# EAGLE design majorproject2_jlcpcb_final (EAGLE 9.2.2)
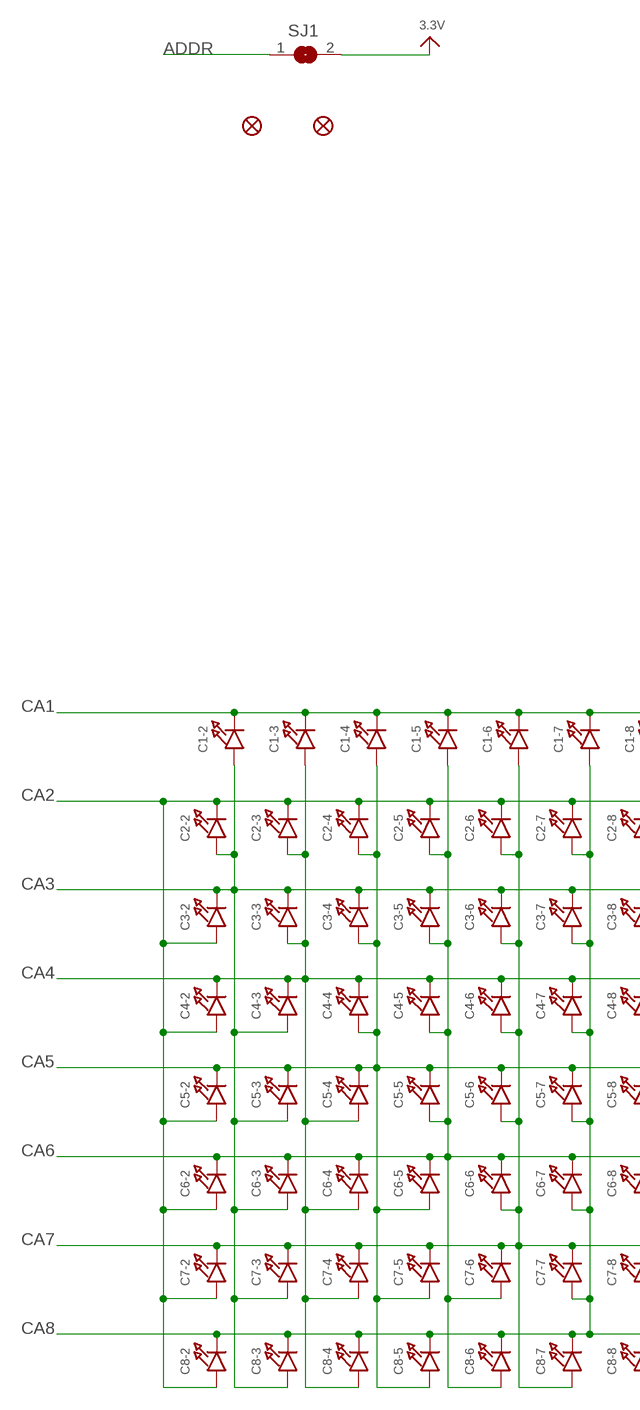
[diagram p0: schematic, sheet 1, part 1 of 2]
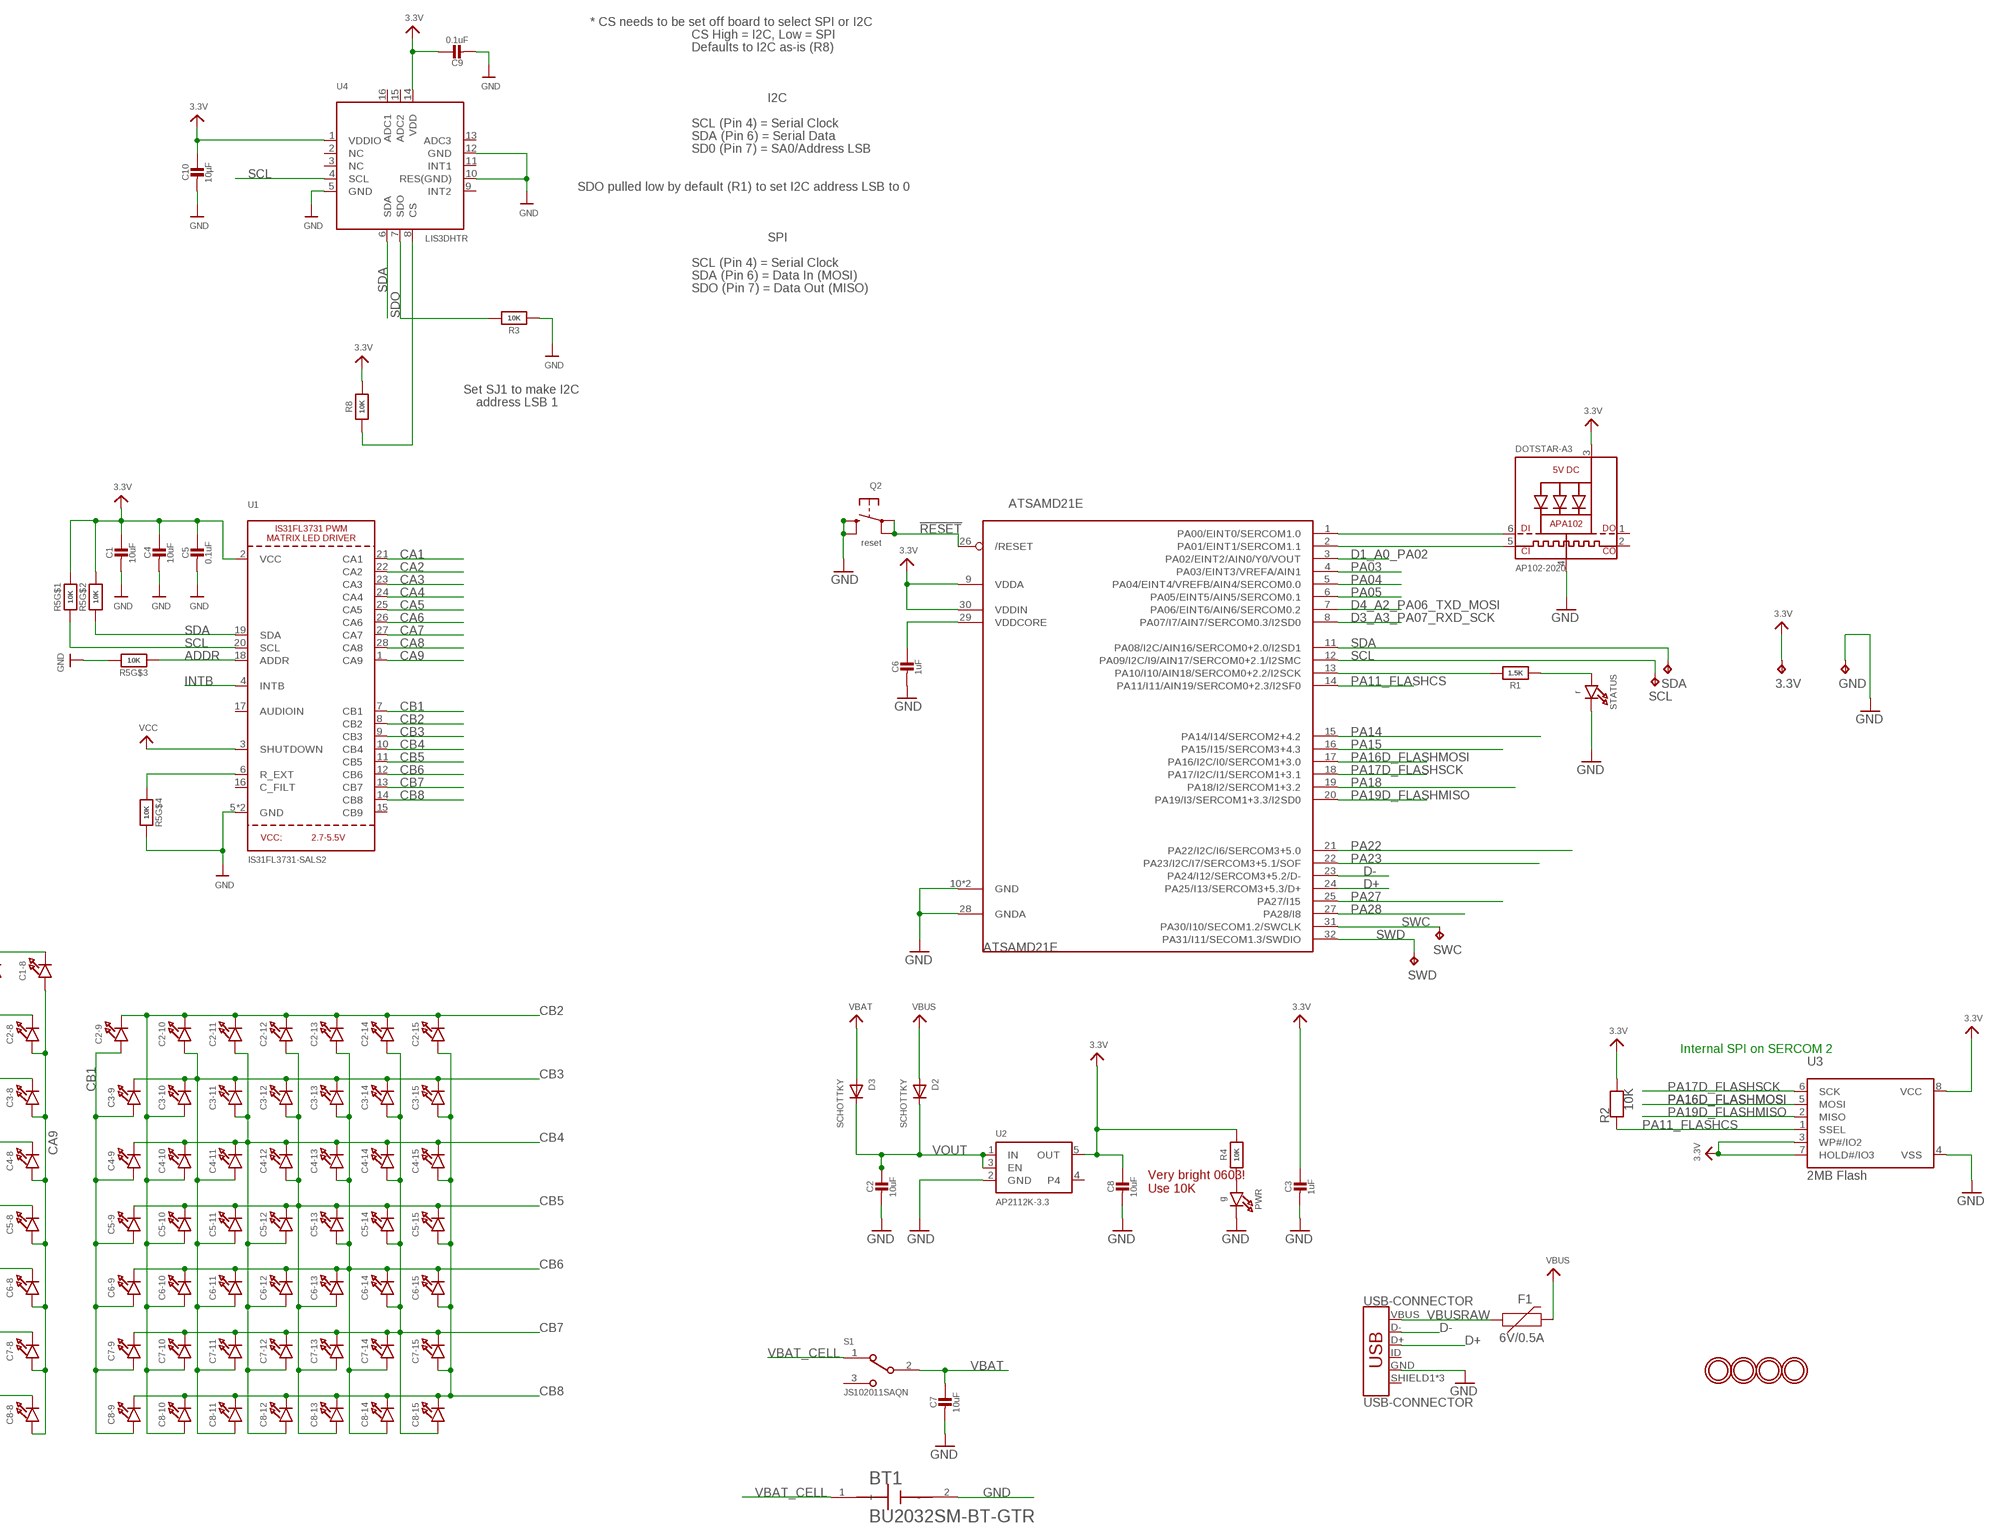
[diagram p1: schematic, sheet 1, part 2 of 2]

## Parts
3.3V  TPB1,27  [B1,27]
ATSAMD21E  ATSAMD21E  [QFN32_5MM]
BT1  BU2032SM-BT-GTR  [BAT_BU2032SM-BT-GTR]
C1  10uF  CAP_CERAMIC0805-NOOUTLINE  [0805-NO]
C1-2  LED0603_NOOUTLINE  [CHIPLED_0603_NOOUTLINE]
C1-3  LED0603_NOOUTLINE  [CHIPLED_0603_NOOUTLINE]
C1-4  LED0603_NOOUTLINE  [CHIPLED_0603_NOOUTLINE]
C1-5  LED0603_NOOUTLINE  [CHIPLED_0603_NOOUTLINE]
C1-6  LED0603_NOOUTLINE  [CHIPLED_0603_NOOUTLINE]
C1-7  LED0603_NOOUTLINE  [CHIPLED_0603_NOOUTLINE]
C1-8  LED0603_NOOUTLINE  [CHIPLED_0603_NOOUTLINE]
C2  10uF  CAP_CERAMIC0805-NOOUTLINE  [0805-NO]
C2-2  LED0603_NOOUTLINE  [CHIPLED_0603_NOOUTLINE]
C2-3  LED0603_NOOUTLINE  [CHIPLED_0603_NOOUTLINE]
C2-4  LED0603_NOOUTLINE  [CHIPLED_0603_NOOUTLINE]
C2-5  LED0603_NOOUTLINE  [CHIPLED_0603_NOOUTLINE]
C2-6  LED0603_NOOUTLINE  [CHIPLED_0603_NOOUTLINE]
C2-7  LED0603_NOOUTLINE  [CHIPLED_0603_NOOUTLINE]
C2-8  LED0603_NOOUTLINE  [CHIPLED_0603_NOOUTLINE]
C2-9  LED0603_NOOUTLINE  [CHIPLED_0603_NOOUTLINE]
C2-10  LED0603_NOOUTLINE  [CHIPLED_0603_NOOUTLINE]
C2-11  LED0603_NOOUTLINE  [CHIPLED_0603_NOOUTLINE]
C2-12  LED0603_NOOUTLINE  [CHIPLED_0603_NOOUTLINE]
C2-13  LED0603_NOOUTLINE  [CHIPLED_0603_NOOUTLINE]
C2-14  LED0603_NOOUTLINE  [CHIPLED_0603_NOOUTLINE]
C2-15  LED0603_NOOUTLINE  [CHIPLED_0603_NOOUTLINE]
C3  1uF  CAP_CERAMIC0603_NO  [0603-NO]
C3-2  LED0603_NOOUTLINE  [CHIPLED_0603_NOOUTLINE]
C3-3  LED0603_NOOUTLINE  [CHIPLED_0603_NOOUTLINE]
C3-4  LED0603_NOOUTLINE  [CHIPLED_0603_NOOUTLINE]
C3-5  LED0603_NOOUTLINE  [CHIPLED_0603_NOOUTLINE]
C3-6  LED0603_NOOUTLINE  [CHIPLED_0603_NOOUTLINE]
C3-7  LED0603_NOOUTLINE  [CHIPLED_0603_NOOUTLINE]
C3-8  LED0603_NOOUTLINE  [CHIPLED_0603_NOOUTLINE]
C3-9  LED0603_NOOUTLINE  [CHIPLED_0603_NOOUTLINE]
C3-10  LED0603_NOOUTLINE  [CHIPLED_0603_NOOUTLINE]
C3-11  LED0603_NOOUTLINE  [CHIPLED_0603_NOOUTLINE]
C3-12  LED0603_NOOUTLINE  [CHIPLED_0603_NOOUTLINE]
C3-13  LED0603_NOOUTLINE  [CHIPLED_0603_NOOUTLINE]
C3-14  LED0603_NOOUTLINE  [CHIPLED_0603_NOOUTLINE]
C3-15  LED0603_NOOUTLINE  [CHIPLED_0603_NOOUTLINE]
C4  10uF  CAP_CERAMIC0805-NOOUTLINE  [0805-NO]
C4-2  LED0603_NOOUTLINE  [CHIPLED_0603_NOOUTLINE]
C4-3  LED0603_NOOUTLINE  [CHIPLED_0603_NOOUTLINE]
C4-4  LED0603_NOOUTLINE  [CHIPLED_0603_NOOUTLINE]
C4-5  LED0603_NOOUTLINE  [CHIPLED_0603_NOOUTLINE]
C4-6  LED0603_NOOUTLINE  [CHIPLED_0603_NOOUTLINE]
C4-7  LED0603_NOOUTLINE  [CHIPLED_0603_NOOUTLINE]
C4-8  LED0603_NOOUTLINE  [CHIPLED_0603_NOOUTLINE]
C4-9  LED0603_NOOUTLINE  [CHIPLED_0603_NOOUTLINE]
C4-10  LED0603_NOOUTLINE  [CHIPLED_0603_NOOUTLINE]
C4-11  LED0603_NOOUTLINE  [CHIPLED_0603_NOOUTLINE]
C4-12  LED0603_NOOUTLINE  [CHIPLED_0603_NOOUTLINE]
C4-13  LED0603_NOOUTLINE  [CHIPLED_0603_NOOUTLINE]
C4-14  LED0603_NOOUTLINE  [CHIPLED_0603_NOOUTLINE]
C4-15  LED0603_NOOUTLINE  [CHIPLED_0603_NOOUTLINE]
C5  0.1uF  CAP_CERAMIC0805-NOOUTLINE  [0805-NO]
C5-2  LED0603_NOOUTLINE  [CHIPLED_0603_NOOUTLINE]
C5-3  LED0603_NOOUTLINE  [CHIPLED_0603_NOOUTLINE]
C5-4  LED0603_NOOUTLINE  [CHIPLED_0603_NOOUTLINE]
C5-5  LED0603_NOOUTLINE  [CHIPLED_0603_NOOUTLINE]
C5-6  LED0603_NOOUTLINE  [CHIPLED_0603_NOOUTLINE]
C5-7  LED0603_NOOUTLINE  [CHIPLED_0603_NOOUTLINE]
C5-8  LED0603_NOOUTLINE  [CHIPLED_0603_NOOUTLINE]
C5-9  LED0603_NOOUTLINE  [CHIPLED_0603_NOOUTLINE]
C5-10  LED0603_NOOUTLINE  [CHIPLED_0603_NOOUTLINE]
C5-11  LED0603_NOOUTLINE  [CHIPLED_0603_NOOUTLINE]
C5-12  LED0603_NOOUTLINE  [CHIPLED_0603_NOOUTLINE]
C5-13  LED0603_NOOUTLINE  [CHIPLED_0603_NOOUTLINE]
C5-14  LED0603_NOOUTLINE  [CHIPLED_0603_NOOUTLINE]
C5-15  LED0603_NOOUTLINE  [CHIPLED_0603_NOOUTLINE]
C6  1uF  CAP_CERAMIC0603_NO  [0603-NO]
C6-2  LED0603_NOOUTLINE  [CHIPLED_0603_NOOUTLINE]
C6-3  LED0603_NOOUTLINE  [CHIPLED_0603_NOOUTLINE]
C6-4  LED0603_NOOUTLINE  [CHIPLED_0603_NOOUTLINE]
C6-5  LED0603_NOOUTLINE  [CHIPLED_0603_NOOUTLINE]
C6-6  LED0603_NOOUTLINE  [CHIPLED_0603_NOOUTLINE]
C6-7  LED0603_NOOUTLINE  [CHIPLED_0603_NOOUTLINE]
C6-8  LED0603_NOOUTLINE  [CHIPLED_0603_NOOUTLINE]
C6-9  LED0603_NOOUTLINE  [CHIPLED_0603_NOOUTLINE]
C6-10  LED0603_NOOUTLINE  [CHIPLED_0603_NOOUTLINE]
C6-11  LED0603_NOOUTLINE  [CHIPLED_0603_NOOUTLINE]
C6-12  LED0603_NOOUTLINE  [CHIPLED_0603_NOOUTLINE]
C6-13  LED0603_NOOUTLINE  [CHIPLED_0603_NOOUTLINE]
C6-14  LED0603_NOOUTLINE  [CHIPLED_0603_NOOUTLINE]
C6-15  LED0603_NOOUTLINE  [CHIPLED_0603_NOOUTLINE]
C7  10uF  CAP_CERAMIC0805-NOOUTLINE  [0805-NO]
C7-2  LED0603_NOOUTLINE  [CHIPLED_0603_NOOUTLINE]
C7-3  LED0603_NOOUTLINE  [CHIPLED_0603_NOOUTLINE]
C7-4  LED0603_NOOUTLINE  [CHIPLED_0603_NOOUTLINE]
C7-5  LED0603_NOOUTLINE  [CHIPLED_0603_NOOUTLINE]
C7-6  LED0603_NOOUTLINE  [CHIPLED_0603_NOOUTLINE]
C7-7  LED0603_NOOUTLINE  [CHIPLED_0603_NOOUTLINE]
C7-8  LED0603_NOOUTLINE  [CHIPLED_0603_NOOUTLINE]
C7-9  LED0603_NOOUTLINE  [CHIPLED_0603_NOOUTLINE]
C7-10  LED0603_NOOUTLINE  [CHIPLED_0603_NOOUTLINE]
C7-11  LED0603_NOOUTLINE  [CHIPLED_0603_NOOUTLINE]
C7-12  LED0603_NOOUTLINE  [CHIPLED_0603_NOOUTLINE]
C7-13  LED0603_NOOUTLINE  [CHIPLED_0603_NOOUTLINE]
C7-14  LED0603_NOOUTLINE  [CHIPLED_0603_NOOUTLINE]
C7-15  LED0603_NOOUTLINE  [CHIPLED_0603_NOOUTLINE]
C8  10uF  CAP_CERAMIC0805-NOOUTLINE  [0805-NO]
C8-2  LED0603_NOOUTLINE  [CHIPLED_0603_NOOUTLINE]
C8-3  LED0603_NOOUTLINE  [CHIPLED_0603_NOOUTLINE]
C8-4  LED0603_NOOUTLINE  [CHIPLED_0603_NOOUTLINE]
C8-5  LED0603_NOOUTLINE  [CHIPLED_0603_NOOUTLINE]
C8-6  LED0603_NOOUTLINE  [CHIPLED_0603_NOOUTLINE]
C8-7  LED0603_NOOUTLINE  [CHIPLED_0603_NOOUTLINE]
C8-8  LED0603_NOOUTLINE  [CHIPLED_0603_NOOUTLINE]
C8-9  LED0603_NOOUTLINE  [CHIPLED_0603_NOOUTLINE]
C8-10  LED0603_NOOUTLINE  [CHIPLED_0603_NOOUTLINE]
C8-11  LED0603_NOOUTLINE  [CHIPLED_0603_NOOUTLINE]
C8-12  LED0603_NOOUTLINE  [CHIPLED_0603_NOOUTLINE]
C8-13  LED0603_NOOUTLINE  [CHIPLED_0603_NOOUTLINE]
C8-14  LED0603_NOOUTLINE  [CHIPLED_0603_NOOUTLINE]
C8-15  LED0603_NOOUTLINE  [CHIPLED_0603_NOOUTLINE]
C9  0.1uF  CAP_CERAMIC0805_10MGAP  [0805_10MGAP]
C10  10µF  CAP_CERAMIC0805-NOOUTLINE  [0805-NO]
D2  SCHOTTKY  DIODE_SOD-123FL  [SOD-123FL]
D3  SCHOTTKY  DIODE_SOD-123FL  [SOD-123FL]
DOTSTAR-A3  AP102-2020  APA1022020  [APA102_2020]
F1  6V/0.5A  PPTC_HALF-AMP  [1206]
FID1  FIDUCIAL""  [FIDUCIAL_1MM]
FID2  FIDUCIAL""  [FIDUCIAL_1MM]
GND  TPB1,27  [B1,27]
PWR  g  LED0603_NOOUTLINE  [CHIPLED_0603_NOOUTLINE]
Q2  reset  SWITCH_TACT_SMT4.6X2.8  [BTN_KMR2_4.6X2.8]
R1  1.5K  RESISTOR_0603_NOOUT  [0603-NO]
R2  10K  RESISTOR_0603_NOOUT  [0603-NO]
R3  10K  RESISTOR0805_NOOUTLINE  [0805-NO]
R4  10K  RESISTOR_0603_NOOUT  [0603-NO]
R5  10K  RESISTOR_4PACK  [RESPACK_4X0603]
R8  10K  RESISTOR0805_NOOUTLINE  [0805-NO]
S1  JS102011SAQN  [SW_JS102011SAQN]
SCL  TPB1,27  [B1,27]
SDA  TPB1,27  [B1,27]
SJ1  SOLDERJUMPER  [SOLDERJUMPER_ARROW_NOPASTE]
STATUS  r  LED0603_NOOUTLINE  [CHIPLED_0603_NOOUTLINE]
SWC  TPB1,27  [B1,27]
SWD  TPB1,27  [B1,27]
U1  IS31FL3731-SALS2  IS31FL3731QFN  [QFN28_4MM_0.4MM]
U2  AP2112K-3.3  VREG_SOT23-5  [SOT23-5]
U3  2MB Flash  SPIFLASH_SOIC8208MIL  [SOIC8_208MIL]
U4  LIS3DHTR  ACCEL_LIS3DHTR  [LGA16_3X3MM]
U$20  MOUNTINGHOLE2.0  [MOUNTINGHOLE_2.0_PLATED]
U$21  MOUNTINGHOLE2.0  [MOUNTINGHOLE_2.0_PLATED]
U$22  MOUNTINGHOLE2.0  [MOUNTINGHOLE_2.0_PLATED]
U$23  MOUNTINGHOLE2.0  [MOUNTINGHOLE_2.0_PLATED]
USB-CONNECTOR  USB-CONNECTOR  USB_MICRO-B_FEMALE-SMT  [USB-B-MICRO-SMD]

## Nets
3.3V: 3.3V.TP ATSAMD21E.9(VDDA) ATSAMD21E.30(VDDIN) C1.1 C3.1 C4.1 C5.1 C8.1 C9.1 C10.1 DOTSTAR-A3.3(VDD) R2.2 R4.2 R5.7 R5.8 R8.2 SJ1.2 U1.2(VCC) U2.5(OUT) U3.3(WP#/IO2) U3.7(HOLD#/IO3) U3.8(VCC) U4.1(VDDIO) U4.14(VDD)
!RESET: ATSAMD21E.26(/RESET) Q2.A'(P1) Q2.A(P)
A3: ATSAMD21E.1(PA00/EINT0/SERCOM1.0) DOTSTAR-A3.6(DI)
ADDR: R5.3 SJ1.1 U1.18(ADDR)
CA1: C1-2.C C1-3.C C1-4.C C1-5.C C1-6.C C1-7.C C1-8.C U1.21(CA1)
CA2: C2-2.C C2-3.C C2-4.C C2-5.C C2-6.C C2-7.C C2-8.C C3-2.A C4-2.A C5-2.A C6-2.A C7-2.A C8-2.A U1.22(CA2)
CA3: C1-2.A C2-2.A C3-2.C C3-3.C C3-4.C C3-5.C C3-6.C C3-7.C C3-8.C C4-3.A C5-3.A C6-3.A C7-3.A C8-3.A U1.23(CA3)
CA4: C1-3.A C2-3.A C3-3.A C4-2.C C4-3.C C4-4.C C4-5.C C4-6.C C4-7.C C4-8.C C5-4.A C6-4.A C7-4.A C8-4.A U1.24(CA4)
CA5: C1-4.A C2-4.A C3-4.A C4-4.A C5-2.C C5-3.C C5-4.C C5-5.C C5-6.C C5-7.C C5-8.C C6-5.A C7-5.A C8-5.A U1.25(CA5)
CA6: C1-5.A C2-5.A C3-5.A C4-5.A C5-5.A C6-2.C C6-3.C C6-4.C C6-5.C C6-6.C C6-7.C C6-8.C C7-6.A C8-6.A U1.26(CA6)
CA7: C1-6.A C2-6.A C3-6.A C4-6.A C5-6.A C6-6.A C7-2.C C7-3.C C7-4.C C7-5.C C7-6.C C7-7.C C7-8.C C8-7.A U1.27(CA7)
CA8: C1-7.A C2-7.A C3-7.A C4-7.A C5-7.A C6-7.A C7-7.A C8-2.C C8-3.C C8-4.C C8-5.C C8-6.C C8-7.C C8-8.C U1.28(CA8)
CA9: C1-8.A C2-8.A C3-8.A C4-8.A C5-8.A C6-8.A C7-8.A C8-8.A U1.1(CA9)
CB1: C2-9.A C3-9.A C4-9.A C5-9.A C6-9.A C7-9.A C8-9.A U1.7(CB1)
CB2: C2-9.C C2-10.C C2-11.C C2-12.C C2-13.C C2-14.C C2-15.C C3-10.A C4-10.A C5-10.A C6-10.A C7-10.A C8-10.A U1.8(CB2)
CB3: C2-10.A C3-9.C C3-10.C C3-11.C C3-12.C C3-13.C C3-14.C C3-15.C C4-11.A C5-11.A C6-11.A C7-11.A C8-11.A U1.9(CB3)
CB4: C2-11.A C3-11.A C4-9.C C4-10.C C4-11.C C4-12.C C4-13.C C4-14.C C4-15.C C5-12.A C6-12.A C7-12.A C8-12.A U1.10(CB4)
CB5: C2-12.A C3-12.A C4-12.A C5-9.C C5-10.C C5-11.C C5-12.C C5-13.C C5-14.C C5-15.C C6-13.A C7-13.A C8-13.A U1.11(CB5)
CB6: C2-13.A C3-13.A C4-13.A C5-13.A C6-9.C C6-10.C C6-11.C C6-12.C C6-13.C C6-14.C C6-15.C C7-14.A C8-14.A U1.12(CB6)
CB7: C2-14.A C3-14.A C4-14.A C5-14.A C6-14.A C7-9.C C7-10.C C7-11.C C7-12.C C7-13.C C7-14.C C7-15.C C8-15.A U1.13(CB7)
CB8: C2-15.A C3-15.A C4-15.A C5-15.A C6-15.A C7-15.A C8-9.C C8-10.C C8-11.C C8-12.C C8-13.C C8-14.C C8-15.C U1.14(CB8)
D1_A0_PA02: ATSAMD21E.3(PA02/EINT2/AIN0/Y0/VOUT)
D3_A3_PA07_RXD_SCK: ATSAMD21E.8(PA07/I7/AIN7/SERCOM0.3/I2SD0)
D4_A2_PA06_TXD_MOSI: ATSAMD21E.7(PA06/EINT6/AIN6/SERCOM0.2)
D+: ATSAMD21E.24(PA25/I13/SERCOM3+5.3/D+) USB-CONNECTOR.D+
D-: ATSAMD21E.23(PA24/I12/SERCOM3+5.2/D-) USB-CONNECTOR.D-
GND: ATSAMD21E.10(GND) ATSAMD21E.28(GNDA) ATSAMD21E.33(GND) BT1.2(-) C1.2 C2.2 C3.2 C4.2 C5.2 C6.2 C7.2 C8.2 C9.2 C10.2 DOTSTAR-A3.4(GND) GND.TP PWR.C Q2.B'(S1) Q2.B(S) R3.1 R5.5 R5.6 STATUS.C U1.5(GND) U1.THERMAL(GND) U2.2(GND) U3.4(VSS) U4.5(GND) U4.10(RES(GND)) U4.12(GND) USB-CONNECTOR.GND
INTB: U1.4(INTB)
N$1: R1.1 STATUS.A
N$2: ATSAMD21E.13(PA10/I10/AIN18/SERCOM0+2.2/I2SCK) R1.2
N$3: R8.1 U4.8(CS)
N$6: PWR.A R4.1
N$8: ATSAMD21E.2(PA01/EINT1/SERCOM1.1) DOTSTAR-A3.5(CKI)
PA03: ATSAMD21E.4(PA03/EINT3/VREFA/AIN1)
PA04: ATSAMD21E.5(PA04/EINT4/VREFB/AIN4/SERCOM0.0)
PA05: ATSAMD21E.6(PA05/EINT5/AIN5/SERCOM0.1)
PA11_FLASHCS: ATSAMD21E.14(PA11/I11/AIN19/SERCOM0+2.3/I2SF0) R2.1 U3.1(SSEL)
PA14: ATSAMD21E.15(PA14/I14/SERCOM2+4.2)
PA15: ATSAMD21E.16(PA15/I15/SERCOM3+4.3)
PA16D_FLASHMOSI: ATSAMD21E.17(PA16/I2C/I0/SERCOM1+3.0) U3.5(MOSI)
PA17D_FLASHSCK: ATSAMD21E.18(PA17/I2C/I1/SERCOM1+3.1) U3.6(SCK)
PA18: ATSAMD21E.19(PA18/I2/SERCOM1+3.2)
PA19D_FLASHMISO: ATSAMD21E.20(PA19/I3/SERCOM1+3.3/I2SD0) U3.2(MISO)
PA22: ATSAMD21E.21(PA22/I2C/I6/SERCOM3+5.0)
PA23: ATSAMD21E.22(PA23/I2C/I7/SERCOM3+5.1/SOF)
PA27: ATSAMD21E.25(PA27/I15)
PA28: ATSAMD21E.27(PA28/I8)
R_EXT: R5.4 U1.6(R_EXT)
SCL: ATSAMD21E.12(PA09/I2C/I9/AIN17/SERCOM0+2.1/I2SMC) R5.1 SCL.TP U1.20(SCL) U4.4(SCL)
SDA: ATSAMD21E.11(PA08/I2C/AIN16/SERCOM0+2.0/I2SD1) R5.2 SDA.TP U1.19(SDA) U4.6(SDA)
SDO: R3.2 U4.7(SDO)
SWC: ATSAMD21E.31(PA30/I10/SECOM1.2/SWCLK) SWC.TP
SWD: ATSAMD21E.32(PA31/I11/SECOM1.3/SWDIO) SWD.TP
VBAT: C7.1 D3.A S1.2
VBAT_CELL: BT1.1(+) S1.1
VBUS: D2.A F1.2
VBUSRAW: F1.1 USB-CONNECTOR.VBUS
VCC: U1.3(SHUTDOWN)
VDDCORE1: ATSAMD21E.29(VDDCORE) C6.1
VOUT: C2.1 D2.C D3.C U2.1(IN) U2.3(EN)
Unconnected: DOTSTAR-A3.1(DO) DOTSTAR-A3.2(CKO) S1.3 U1.15(CB9) U1.16(C_FILT) U1.17(AUDIOIN) U2.4 U4.2(NC) U4.3(NC) U4.9(INT2) U4.11(INT1) U4.13(ADC3) U4.15(ADC2) U4.16(ADC1) USB-CONNECTOR.ID USB-CONNECTOR.SHIELD1(SHIELD) USB-CONNECTOR.SHIELD2(SHIELD) USB-CONNECTOR.SHIELD3(SHIELD)

## Notes on the sheet
- * CS needs to be set off board to select SPI or I2C
- CS High = I2C, Low = SPI
- Defaults to I2C as-is (R8)
- I2C
- SCL (Pin 4) = Serial Clock
- SDA (Pin 6) = Serial Data
- SD0 (Pin 7) = SA0/Address LSB
- SDO pulled low by default (R1) to set I2C address LSB to 0
- SPI
- SCL (Pin 4) = Serial Clock
- SDA (Pin 6) = Data In (MOSI)
- SDO (Pin 7) = Data Out (MISO)
- Set SJ1 to make I2C
- address LSB 1
- Internal SPI on SERCOM 2
- Very bright 0603!
  Use 10K

## Library data of the parts
3.3V GND SCL SDA SWC SWD = testpad:TP: Test pad
ATSAMD21E = microbuilder:ATSAMD21E
BT1 = BU2032SM-BT-GTR:BU2032SM-BT-GTR: Holder Cr2032 Gold Leads Smd; DESCRIPTION: Holder Cr2032 Gold Leads Smd; DIGI-KEY_PART_NUMBER: BU2032SM-BT-GCT-ND; DIGI-KEY_PURCHASE_URL: https://www.digikey.ca/product-detail/en/mpd-memory-protection-devices/BU2032SM-BT-GTR/BU2032SM-BT-GCT-ND/3628531?utm_source=snapeda&utm_medium=aggregator&utm_campaign=symbol; MF: MPD; MP: BU2032SM-BT-GTR; PACKAGE: None
C1-C10 = microbuilder:CAP_CERAMIC: Ceramic Capacitors For new designs, use the packages preceded by an '_' character since they are more reliable: The following footprints should be used on most boards: _0402 - Standard footprint for regular board layouts _0603 - Standard footprint for regular board layouts _0805 - Standard footprint for regular board layouts _1206 - Standard footprint for regular board layouts For extremely tight-pitch boards where space is at a premium, the following 'micro-pitch' footprints can be used (smaller pads, no silkscreen outline, etc.): _0402MP - Micro-pitch footprint for very dense/compact boards _0603MP - Micro-pitch footprint for very dense/compact boards _0805MP - Micro-pitch footprint for very dense/compact boards _1206MP - Micro-pitch footprint for very dense/compact boards
C1-2-C1-8 C2-2-C2-15 C3-2-C3-15 C4-2-C4-15 C5-2-C5-15 C6-2-C6-15 C7-2-C7-15 C8-2-C8-15 PWR STATUS = microbuilder:LED: LED 0603 - 0603 Surface Mount Package 2mA: Green LED - Low Power (3.9mcd, 2ma, 1.7Vf) - Digikey: 475-2709-2-ND Orange LED - Low Power (9.8mcd, 2ma, 1.8Vf) - Digikey: 475-1194-2-ND Red LED - Low Power (5mcd, 2ma, 1.8Vf) - Digikey: 475-1195-2-ND Yellow LED - Low Power (7mcd, 2ma, 1.8Vf) - Digikey: 475-1196-2-ND 5mA: Blue LED - Low Power (17mcd, 5ma, 2.9Vf) - Digikey: LNJ937W8CRACT-ND 0805 - 0805 Surface Mount Package 2mA: Red LED (8.8mcd, 2mA, 1.8Vf, Clear) - Low Power [Digikey: 475-2510-1-ND] Green LED (5mcd, 2mA, 1.8Vf, Clear) - Low Power [Digikey: 475-2730-1-ND] Yellow LED (11.3mcd, 2mA, 1.8Vf, Clear) - Low Power [Digikey: 475-2555-1-ND] 20mA: Red LED (104mcd, 20mA, Diffused) - LS R976 [Digikey: 475-1278-6-ND] Red LED (12mcd, 20mA, 2.0Vf, Clear) - APT2012EC [Digikey: 754-1128-1-ND] Green LED (15mcd, 20mA, 2.2Vf, Clear) - APT2012GC [Digikey: 754-1131-1-ND] Orange LED (160mcd, 20mA, 2.1Vf, Clear) - APT2012SECK [Digikey: 754-1130-1-ND] 1206 - 1206 Surface Mount Package Green LED (26mcd, 20mA, Diffused) - LG N971 [Digikey: 475-1407-6-ND] Red LED (15mcd, 20mA, Diffused) - LH N974 [Digikey: 475-1416-6-ND] Cree - Cree High-Power Surface Mount LEDs XPEBWT-L1-0000-00D50 - White 111lm 350mA 2.9Vf 6200K 110° XTEAWT-00-0000-00000LEE3 - White 114lm 350mA 2.85Vf 5000K 115° Everlight - Everlight 45-21 Series Surface Mount LEDs 45-21/QK2C-B2832AC2CB2/2T - Warm White 2000mcd 20mA 3.25Vf 3050K 120° 45-21/LK2C-B38452C4CB2/2T - Nuetral White 2000mcd 20mA 3.25Vf 4150K 120° 45-21/LK2C-B50634C6CB2/2T - Cold White 2200mcd 20mA 3.25Vf 5650K 120° PLCC2 Reverse Mount LS T77K-J1L2-1-0-2-R18-Z - Red 11.25mcd 2mA 1.8Vf 630nm 120° LO T77K-L1M2-24-Z - Orange 19.6mcd 2mA 1.8Vf 606nm 120° LY T77K-K2M1-26-Z - Yellow 15.7mcd 2mA 1.8Vf 587nm 120°
D2 D3 = adafruit:DIODE: Diode SMADIODE - SMA Surface Mount Package 20V 1A Schottky Diode Digikey: 641-1014-6-ND DO-1N4148 - Through Hole Small Current Diode SOD-123 20V 1 A (.5mV Vf) Schottky Diode - Digikey: MBRX120TPMSCT-ND SOD-323 10V 570mA (.38mV Vf, 3ns) Schottky Diode - Digikey: ZLLS410CT-ND SOD-523 30V 30mA Schottky Diode (RB751S-40TE61) - Digikey: RB751S-40TE61CT-ND SOT23-R/W - SOT23 Package (R = Solder Paste/Reflow Ovens, W = Hand-Soldering) BAT54Film 40V 300mA - Digikey: 497-7162-1-ND
DOTSTAR-A3 = microbuilder:APA102: APA102/DotStar Pixels VCC: 5V DC Refresh Rate: 400Hz
F1 = SparkFun-Fuses:PPTC: Resettable Fuse PPTC Resettable Fuse. Really a sort of resistor with a polymeric positive temperature coefficient whose resistance increases dramatically with an increase in temperature. When heated by the power passing through the resistance rises causing the current to be limited, protecting the circuit. This is achieved by the transition of the polymer from a crystalline to an amorphous state where the conductive carbon separates breaking the conductive pathways found in the cool crystalline structure. When a PPTC cools back down it resumes conducting letting the circuit turn back on. SparkFun Products: SparkFun RedBoard - Programmed with Arduino <https://www.sparkfun.com/products/12757> Pro Micro - 5V/16MHz <https://www.sparkfun.com/products/12640> Arduino Pro 328 - 5V/16MHz <https://www.sparkfun.com/products/10915> MP3 Trigger <https://www.sparkfun.com/products/13720>; PROD_ID: RES-08585
FID1 FID2 = microbuilder:FIDUCIAL: Fiducial Alignment Points Various fiducial points for machine vision alignment.; BOM: EXCLUDE
Q2 = microbuilder:SWITCH_TACT_SMT: SMT Tact Switches 6x6mm - Digikey: P12940SCT-ND KMR2 (4.6x2.8mm) - Digikey: 401-1426-1-ND EVQ-PQHB55 - Light Touch, 160GF (4.5x4.5mm) - Digikey: P8090SCT-ND KMT0 - KMT021 NGJ LHS (etc.) IP68/Waterproof - Digikey: CKN10289CT-ND
R1-R4 R8 = microbuilder:RESISTOR: Resistors For new designs, use the packages preceded by an '_' character since they are more reliable: The following footprints should be used on most boards: _0402 - Standard footprint for regular board layouts _0603 - Standard footprint for regular board layouts _0805 - Standard footprint for regular board layouts _1206 - Standard footprint for regular board layouts For extremely tight-pitch boards where space is at a premium, the following 'micro-pitch' footprints can be used (smaller pads, no silkscreen outline, etc.): _0402MP - Micro-pitch footprint for very dense/compact boards _0603MP - Micro-pitch footprint for very dense/compact boards _0805MP - Micro-pitch footprint for very dense/compact boards _1206MP - Micro-pitch footprint for very dense/compact boards
R5 = microbuilder:RESISTOR_4PACK: Resistor Packs (4 resistors) 4 x 0603 10K 1/16W - Digikey: YC164J-10KCT-ND
S1 = JS102011SAQN:JS102011SAQN: JS10 Series SPDT On-On 6 V 0.3 A Gull Wing SMT Slide Switch http://www.snapeda.com/parts/JS102011SAQN/C%26K%20Components/view-part/; AVAILABILITY: Unavailable; DESCRIPTION: JS10 Series SPDT On-On 6 V 0.3 A Gull Wing SMT Slide Switch; MF: C&K; MP: JS102011SAQN; PACKAGE: None; PRICE: None
SJ1 = microbuilder:SOLDERJUMPER: SMD Solder JUMPER Solder the two pads together to create a connection, or remove the solder to break it. REFLOW - Use this footprint for solder paste and reflow ovens. WAVE - Use this footprint for hand-soldering (larger pads). CLOSED - Has a trace between the two pads to ensure it is closed by default. The trace needs to be cut to disable the jumper, and can be closed again by creating a solder bridge between the two pads.; BOM: EXCLUDE
U1 = microbuilder:IS31FL3731: IS31FL3731 PWM LED Matrix Driver
U2 = microbuilder:VREG_SOT23-5: SOT23-5 Fixed Voltage Regulators Part Current Out V Out V In V Dropout θJA (°C/W) TJ (°C) Digikey Part No. ADP121 150mA 3.3V 3.4-5.5V 0.09V @ 150mA -- -- ADP121-AUJZ33R7CT-ND ADP121 150mA 3.0V 3.1-5.5V 0.09V @ 150mA -- -- ADP121-AUJZ30R7CT-ND ADP122 300mA 3.3V 3.4-5.5V 0.085V @ 300mA -- -- ADP122AUJZ-3.3-R7CT-ND ADP1712 300mA 3.3V 3.5-5.5V 0.17V @ 300mA -- -- ADP1712AUJZ-3.3-R7TR-ND AP7311 (Low Cost) 150mA 3.3V 3.5-6V 0.15V @ 150mA -- -- AP7311-33WG-7DICT-ND LD39015M18R 150mA 1.8V 1.9V-5.5V 0.08V @ 100mA -- -- 497-6977-1-ND LP2985A-33DBVR 150mA 3.3V 3.3-16V 0.28V @ 150mA 206 150 296-18479-1-ND MCP1824T-3302E/OT 300mA 3.3V 3.5V-6V 0.2V @ 300mA -- -- MCP1824T-3302E/OTCT-ND MIC5205-2.5YM5 TR 150mA 2.5V 2.7-16V 0.165V @ 150mA -- -- 576-1257-2-ND MIC5205-3.0YM5 TR 150mA 3.0V 3.2V-16V 0.165V @ 150mA -- -- 576-1258-2-ND MIC5205-3.3YM5 TR 150mA 3.3V 3.5V-16V 0.165V @ 150mA -- -- 576-1259-2-ND TPS780330220 150mA 3.3V+2.2V 3.6-5.5V 250mV Max -- -- 296-23332-1-ND TDA3663/N1,135 100mA 3.3V 3.5-45V 0.18V @ 50mA -- -- 568-5343-1-ND Max operating temp can be calculated using θJA, TJ (max junction temperature), and power in watts. Set the "Maximum Ambient Temperature" until it reaches TJ ("Max Junction Temperature"), which is the absolute limit for safe use of the regulator: Heat Sink Temperature Calculator <http://www.daycounter.com/Calculators/Heat-Sink-Temperature-Calculator.phtml> For example, With 12V source into a 3.3V LP2985 and a 30mA load, we are dissipating (12V-3.3V) * 0.03A = 0.261W. With a θJA of 206 °C/W, a TJ of 150°C, and 261mW we can safely use the chip without a heat sink up to 75°C (=147.1°C Junction Temperature).
U3 = microbuilder:SPIFLASH_SOIC8: SOIC8 SPI Flash Be careful with the size since SOIC8 flash comes in several 'widths' SOIC8 150 mil M25P16 - 16Mbit (2Mbit x 8) Serial Flash (75MHz SPI Bus), Supply: 2.7-3.6V Digikey: SOIC8 - M25P16-VMN6P-ND SOIC8 208 mil W25Q16BVSSIG - 16Mbit (2Mbit x 8) Serial Flash (104MHz SPI Bus), Supply: 2.7-3.6V Digikey: SOIC8 - W25Q16BVSSIG-ND
U4 = microbuilder:ACCEL_LIS3DHTR: LIS3DHTR 3-Axis Accelerometer with I2C/SPI Interface VDD: 1.71-3.6V VDDIO: 1.71-VDD+0.1V Scale: +/-2g, 4g, 8g, 16g with 16--bit data output Temp:: -40°C - 85°C Mouser: 511-LIS3DHTR Digikey: 497-10613-1-ND
U$20-U$23 = microbuilder:MOUNTINGHOLE: Mounting Hole For #2 screws (0.086"/2.18mm width, 0.094"/2.4mm hole) use 2.5mm; BOM: EXCLUDE
USB-CONNECTOR = SparkFun-Connectors:USB_MICRO-B: USB Type Micro-B Connector Male/female and PTH/SMT variants SparkFun Products: SparkFun microB USB Breakout <https://www.sparkfun.com/products/12035> SparkFun USB microB Plug Breakout <https://www.sparkfun.com/products/10031> SparkFun ESP8266 Thing <https://www.sparkfun.com/products/13231>; PROD_ID: CONN-11752

## Board
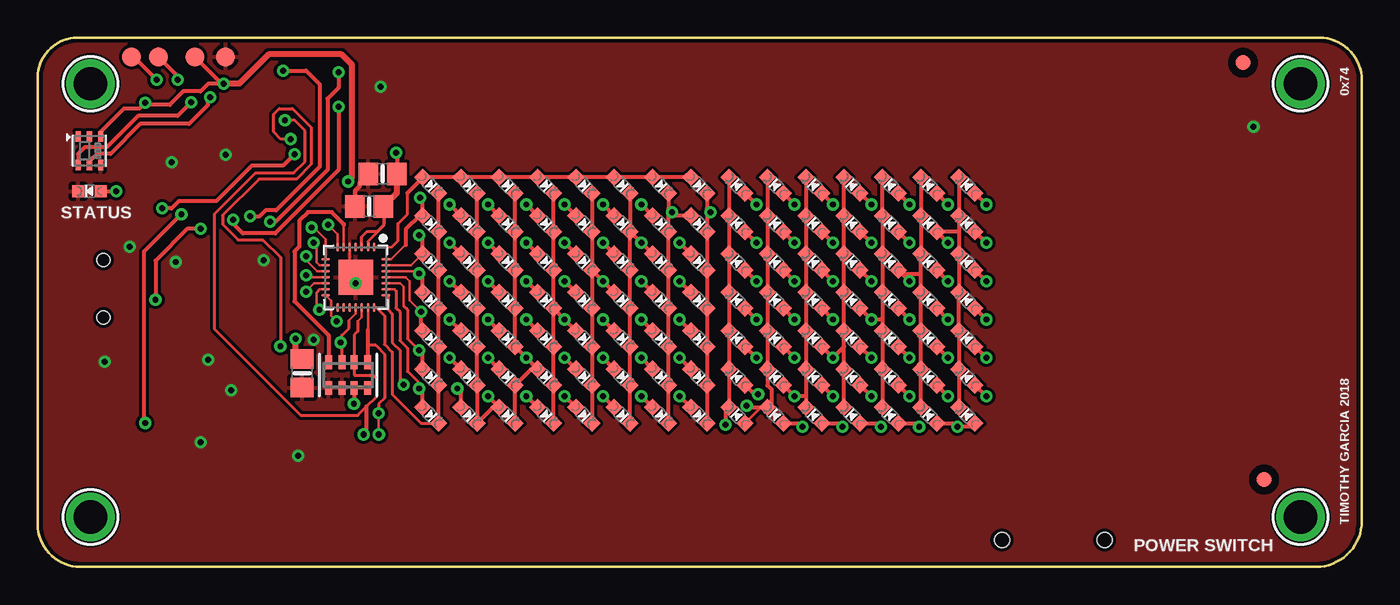
[diagram p2: board, top side]
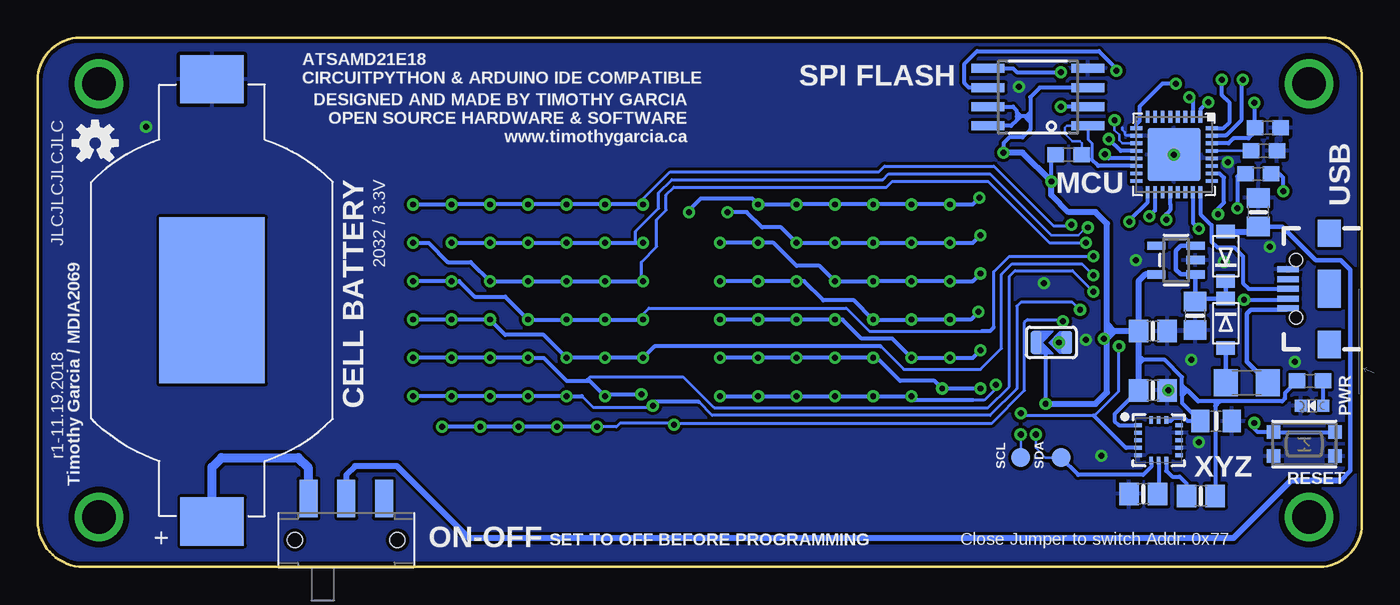
[diagram p3: board, bottom side, seen from below]

Size 87.76 x 35.05 mm. Coordinates in mm from the lower left corner, seen from the top.
Outline: 2.82,0 84.73,0 arc90 87.76,3.02 87.76,32.24 arc90 84.94,35.05 2.63,35.05 arc90 0,32.42 0,2.81 arc90 2.82,0
Copper layers (1*16): Top 0.035mm / dielectric 1.5mm / Bottom 0.035mm
Design rules "adafruit *": minimum track width 7mil, minimum drill 15.5mil, track to track 8mil, track to pad 8mil, pad to pad 8mil, via to via 8mil, smd to smd 8mil, copper to edge 10mil, drill to drill 8mil, minimum pad ring 10mil, minimum via ring 8mil, stop-mask expansion 2mil, vias tented up to drill 20mil, thermal gap 10mil

### Footprints (pad centres in the part's own frame; a part is rotated, then mirrored left to right if it is on the bottom)
B1,27 = smd 1.27 x 1.27: TP 0,0
QFN32_5MM = smd 0.8 x 0.25: 1 -2.5,1.75; 2 -2.5,1.25; 3 -2.5,0.75; 4 -2.5,0.25; 5 -2.5,-0.25; 6 -2.5,-0.75; 7 -2.5,-1.25; 8 -2.5,-1.75; 17 2.5,-1.75; 18 2.5,-1.25; 19 2.5,-0.75; 20 2.5,-0.25; 21 2.5,0.25; 22 2.5,0.75; 23 2.5,1.25; 24 2.5,1.75 | smd 0.25 x 0.8: 9 -1.75,-2.5; 10 -1.25,-2.5; 11 -0.75,-2.5; 12 -0.25,-2.5; 13 0.25,-2.5; 14 0.75,-2.5; 15 1.25,-2.5; 16 1.75,-2.5; 25 1.75,2.5; 26 1.25,2.5; 27 0.75,2.5; 28 0.25,2.5; 29 -0.25,2.5; 30 -0.75,2.5; 31 -1.25,2.5; 32 -1.75,2.5 | smd 3.5 x 3.5: 33 0,0
BAT_BU2032SM-BT-GTR = smd 3.2 x 4.2: 1 -14.65,0; 2 14.65,0 | smd 11 x 7: 3 0,0
0805-NO = smd 1.3 x 1.5: 1 -0.95,0; 2 0.95,0
CHIPLED_0603_NOOUTLINE = smd 0.8 x 0.8: A 0,-0.75; C 0,0.75
0603-NO = smd 1.1 x 1: 1 -0.85,0; 2 0.85,0
0805_10MGAP = smd 1.2 x 1.5: 1 -1.05,0; 2 1.05,0
SOD-123FL = smd 0.91 x 1.22: A 1.637,0; C -1.637,0
APA102_2020 = smd 0.7 x 0.35: 1 -0.95,-0.75; 2 -0.95,0; 3 -0.95,0.75; 4 0.95,0.75; 5 0.95,0; 6 0.95,-0.75
1206 = smd 1.6 x 1.8: 1 -1.4,0; 2 1.4,0
FIDUCIAL_1MM = smd 1 x 1: 1 0,0
BTN_KMR2_4.6X2.8 = smd 0.9 x 0.9: A 2.05,0.8; A' -2.05,0.8; B 2.05,-0.8; B' -2.05,-0.8
RESPACK_4X0603 = smd 0.45 x 0.9: 1 -1.3,-0.85; 2 -0.4,-0.85; 3 0.4,-0.85; 4 1.3,-0.85; 5 1.3,0.85; 6 0.4,0.85; 7 -0.4,0.85; 8 -1.3,0.85
SW_JS102011SAQN = smd 1.2 x 2.5: 1 -2.5,2.75; 2 0,2.75; 3 2.5,2.75 | hole 1: -3.4,0; 3.4,0
SOLDERJUMPER_ARROW_NOPASTE = smd 0.762 x 1.524: 1 -1.016,0; 2 1.016,0
QFN28_4MM_0.4MM = smd 0.6 x 0.18: 1 -2,1.2; 2 -2,0.8; 3 -2,0.4; 4 -2,0; 5 -2,-0.4; 6 -2,-0.8; 7 -2,-1.2; 15 2,-1.2; 16 2,-0.8; 17 2,-0.4; 18 2,0; 19 2,0.4; 20 2,0.8; 21 2,1.2 | smd 0.18 x 0.6: 8 -1.2,-2; 9 -0.8,-2; 10 -0.4,-2; 11 0,-2; 12 0.4,-2; 13 0.8,-2; 14 1.2,-2; 22 1.2,2; 23 0.8,2; 24 0.4,2; 25 0,2; 26 -0.4,2; 27 -0.8,2; 28 -1.2,2 | smd 2.3 x 2.3: THERMAL 0,0
SOT23-5 = smd 0.55 x 1.2: 1 -0.95,-1.3; 2 0,-1.3; 3 0.95,-1.3; 4 0.95,1.3; 5 -0.95,1.3
SOIC8_208MIL = smd 0.6 x 2.2: 1 -1.905,-3.315; 2 -0.635,-3.315; 3 0.635,-3.315; 4 1.905,-3.315; 5 1.905,3.315; 6 0.635,3.315; 7 -0.635,3.315; 8 -1.905,3.315
LGA16_3X3MM = smd 0.5 x 0.25: 1 -1.35,1; 2 -1.35,0.5; 3 -1.35,0; 4 -1.35,-0.5; 5 -1.35,-1; 9 1.35,-1; 10 1.35,-0.5; 11 1.35,0; 12 1.35,0.5; 13 1.35,1 | smd 0.25 x 0.5: 6 -0.5,-1.35; 7 0,-1.35; 8 0.5,-1.35; 14 0.5,1.35; 15 0,1.35; 16 -0.5,1.35
MOUNTINGHOLE_2.0_PLATED = drill 2.2 pad 3: P$1 0,0
USB-B-MICRO-SMD = smd 1.45 x 0.4: D+ 2.725,0; D- 2.725,0.65; GND 2.725,-1.3; ID 2.725,-0.65; VBUS 2.725,1.3 | smd 1.5 x 1.8: SHIELD1 0,3.685; SHIELD2 0,-3.685 | smd 1.5 x 2.5: SHIELD3 0,0 | hole 0.85: 2.2,1.9; 2.2,-1.9

### Placement (x,y rotation side)
3.3V  10.41,33.78 0 top
ATSAMD21E  12.45,27.3 270 bottom
BT1  76.2,17.65 90 bottom
C1  17.53,12.83 270 top
C1-2  26.04,10.03 225 top
C1-3  26.04,12.57 225 top
C1-4  26.04,15.11 225 top
C1-5  26.04,17.65 225 top
C1-6  26.04,20.19 225 top
C1-7  26.04,22.73 225 top
C1-8  26.04,25.27 225 top
C2  11.05,16.64 270 bottom
C2-2  28.58,10.03 225 top
C2-3  28.58,12.57 225 top
C2-4  28.58,15.11 225 top
C2-5  28.58,17.65 225 top
C2-6  28.58,20.19 225 top
C2-7  28.58,22.73 225 top
C2-8  28.58,25.27 225 top
C2-9  61.59,25.27 45 top
C2-10  61.59,22.73 45 top
C2-11  61.59,20.19 45 top
C2-12  61.59,17.65 45 top
C2-13  61.59,15.11 45 top
C2-14  61.59,12.57 45 top
C2-15  61.59,10.03 45 top
C3  6.22,29.08 0 bottom
C3-2  31.12,10.03 225 top
C3-3  31.12,12.57 225 top
C3-4  31.12,15.11 225 top
C3-5  31.12,17.65 225 top
C3-6  31.12,20.19 225 top
C3-7  31.12,22.73 225 top
C3-8  31.12,25.27 225 top
C3-9  59.05,25.27 45 top
C3-10  59.05,22.73 45 top
C3-11  59.05,20.19 45 top
C3-12  59.05,17.65 45 top
C3-13  59.05,15.11 45 top
C3-14  59.05,12.57 45 top
C3-15  59.05,10.03 45 top
C4  22.86,26.04 180 top
C4-2  33.65,10.03 225 top
C4-3  33.65,12.57 225 top
C4-4  33.65,15.11 225 top
C4-5  33.65,17.65 225 top
C4-6  33.65,20.19 225 top
C4-7  33.65,22.73 225 top
C4-8  33.65,25.27 225 top
C4-9  56.52,25.27 45 top
C4-10  56.52,22.73 45 top
C4-11  56.52,20.19 45 top
C4-12  56.52,17.65 45 top
C4-13  56.52,15.11 45 top
C4-14  56.52,12.57 45 top
C4-15  56.52,10.03 45 top
C5  21.97,23.88 180 top
C5-2  36.2,10.03 225 top
C5-3  36.2,12.57 225 top
C5-4  36.2,15.11 225 top
C5-5  36.2,17.65 225 top
C5-6  36.2,20.19 225 top
C5-7  36.2,22.73 225 top
C5-8  36.2,25.27 225 top
C5-9  53.97,25.27 45 top
C5-10  53.97,22.73 45 top
C5-11  53.97,20.19 45 top
C5-12  53.97,17.65 45 top
C5-13  53.97,15.11 45 top
C5-14  53.97,12.57 45 top
C5-15  53.97,10.03 45 top
C6  6.48,27.56 0 bottom
C6-2  38.73,10.03 225 top
C6-3  38.73,12.57 225 top
C6-4  38.73,15.11 225 top
C6-5  38.73,17.65 225 top
C6-6  38.73,20.19 225 top
C6-7  38.73,22.73 225 top
C6-8  38.73,25.27 225 top
C6-9  51.43,25.27 45 top
C6-10  51.43,22.73 45 top
C6-11  51.43,20.19 45 top
C6-12  51.43,17.65 45 top
C6-13  51.43,15.11 45 top
C6-14  51.43,12.57 45 top
C6-15  51.43,10.03 45 top
C7  6.86,23.5 90 bottom
C7-2  41.27,10.03 225 top
C7-3  41.27,12.57 225 top
C7-4  41.27,15.11 225 top
C7-5  41.27,17.65 225 top
C7-6  41.27,20.19 225 top
C7-7  41.27,22.73 225 top
C7-8  41.27,25.27 225 top
C7-9  48.89,25.27 45 top
C7-10  48.89,22.73 45 top
C7-11  48.89,20.19 45 top
C7-12  48.89,17.65 45 top
C7-13  48.89,15.11 45 top
C7-14  48.89,12.57 45 top
C7-15  48.89,10.03 45 top
C8  13.84,15.62 0 bottom
C8-2  43.81,10.03 225 top
C8-3  43.81,12.57 225 top
C8-4  43.81,15.11 225 top
C8-5  43.81,17.65 225 top
C8-6  43.81,20.19 225 top
C8-7  43.81,22.73 225 top
C8-8  43.81,25.27 225 top
C8-9  46.35,25.27 45 top
C8-10  46.35,22.73 45 top
C8-11  46.35,20.19 45 top
C8-12  46.35,17.65 45 top
C8-13  46.35,15.11 45 top
C8-14  46.35,12.57 45 top
C8-15  46.35,10.03 45 top
C9  9.65,9.65 0 bottom
C10  13.84,11.68 0 bottom
D2  9.02,16.13 270 bottom
D3  9.02,20.57 90 bottom
DOTSTAR-A3  3.43,27.56 270 top
F1  7.62,12.19 180 bottom
FID1  81.28,5.78 0 top
FID2  79.88,33.4 0 top
GND  12.45,33.78 0 top
PWR  3.3,10.67 90 bottom
Q2  3.81,8.13 0 bottom
R1  6.86,26.04 180 bottom
R2  19.43,27.3 180 bottom
R3  14.48,4.83 0 bottom
R4  3.43,12.32 180 bottom
R5  20.57,12.7 180 top
R8  10.67,4.7 0 bottom
S1  67.31,1.78 0 bottom
SCL  22.61,7.24 0 bottom
SDA  19.94,7.24 0 bottom
SJ1  20.57,14.86 180 bottom
STATUS  3.43,24.89 90 top
SWC  6.22,33.78 0 top
SWD  8,33.78 0 top
U1  21.08,19.18 270 top
U2  12.32,20.32 90 bottom
U3  21.46,31.11 90 bottom
U4  13.46,8.38 0 bottom
U$20  3.49,3.3 0 top
U$21  3.49,32 0 top
U$22  83.69,3.3 0 top
U$23  83.69,32 0 top
U$30  [OSHW-LOGO-S]  83.95,28.07 0 bottom
USB-CONNECTOR  2.16,18.41 180 bottom

### Tracks (layer width: path | path; a pad name or v marks a point on that pad's centre or on a via)
3.3V  (via drill 0.39)
  Top 0.203: C5.1 22.92,22.61 21.88,21.57 U1.2
  Top 0.254: R5.8 R5.7 20.97,10.81 v20.96,10.79 | v23.75,27.43 23.81,27.37 C4.1 | DOTSTAR-A3.3 4.18,28.82 5.71,30.35 6.73,30.35 v7.11,30.73 7.24,30.61 8.76,30.61 9.65,31.5 10.79,31.5 11.3,32 v12.32,32 12.19,32 3.3V.TP | C1.1 17.08,14.22
  Top 0.406: C5.1 23.81,24.77 C4.1 | 17.08,14.22 v17.08,15.11 | v12.32,32 13.36,32 15.31,33.95 20.15,33.95 20.83,33.27 20.83,25.78 v20.57,25.53
  Bottom 0.178: 9.9,28.01 ATSAMD21E.30
  Bottom 0.254: v20.96,10.79 20.96,14.22 SJ1.2 | v20.57,25.53 20.57,27.05 20.54,27.05 R2.2 | U3.7 23.11,30.48 22.86,30.23 22.86,30.1 | U3.8 23.24,29.21 22.86,29.59 | 22.86,30.1 22.86,29.84 | 22.86,29.84 22.86,29.59 | U3.3 21.34,31.75 21.97,31.11 21.97,30.1 | 21.97,30.1 21.97,29.97 | 21.97,29.97 22.1,29.84 22.23,29.84 | 22.23,29.84 22.61,29.84 | 22.61,29.84 22.86,29.84 | v12.32,32 13.21,32 14.73,30.48 14.73,29.52 14.95,29.31 ATSAMD21E.9 | ATSAMD21E.30 8.84,28.05 8.51,28.39 7.51,28.39 7.07,28.83 C3.1 7.11,29.12 v7.11,30.73 | 21.97,29.97 21.97,29.46 | 21.97,29.46 21.97,28.96 22.48,28.45 23.37,28.45 23.75,28.07 v23.75,27.43 | 21.97,29.46 22.23,29.72 22.23,29.84 | 22.23,29.84 21.97,30.1 | 22.61,29.84 22.86,30.1 | 22.61,29.84 22.86,29.59 | C10.1 16.38,10.09 16.38,9.65 16.11,9.38 U4.1 | 11.91,11.33 11.91,11.68 | 11.91,11.68 11.91,12.04 | 11.91,12.04 11.91,12.57 13.06,13.72 14.48,13.72 | 14.48,13.72 14.79,13.72 | 14.48,13.72 14.79,13.4 14.79,13.33 | 14.48,13.72 14.79,14.03 14.79,14.22 | 11.56,11.68 11.91,11.68 | 9.4,10.96 5.28,10.96 5.09,11.15 5.09,11.51 R4.2 | 9.4,10.96 9.78,10.96 | 11.56,11.68 11.91,11.33 | 11.91,11.33 11.91,10.86 C9.1 11.54,9.65 11.72,9.84 12.5,9.84 12.68,9.65 12.88,9.65 U4.14 | 11.56,11.68 11.91,12.04 | 9.78,10.96 9.72,10.9 9.72,10.64 | 9.72,10.64 R8.2 | 9.4,10.96 9.72,10.64 | 9.78,10.96 10.83,10.96
  Bottom 0.305: R4.2 4.41,12.19 | 10.83,10.96 11.56,11.68
  Bottom 0.406: v20.96,10.79 17.65,10.79 16.89,11.56 16.89,15.11 | 16.89,15.11 16.89,15.49 | 16.89,15.49 16.89,16.13 | 16.89,16.13 16.89,22.73 17.65,23.5 19.43,23.5 20.57,24.64 v20.57,25.53 22.48,27.43 v23.75,27.43 | 16.89,15.11 v17.08,15.11 | C8.1 16.38,15.62 | 16.38,15.62 16.76,15.62 16.89,15.49 | 16.89,16.13 16.38,15.62 | 16.38,15.62 16.89,15.11 | U2.5 14.35,19.37 14.79,18.93 C8.1 | C8.1 14.79,14.22 14.79,13.72 14.79,13.33 C10.1
!RESET  (via drill 0.39)
  Top 0.254: v7.11,9.52 7.03,9.61 7.03,20.87 v9.52,23.37
  Bottom 0.254: Q2.A Q2.A' 6.9,8.93 7.11,9.14 v7.11,9.52 | v9.52,23.37 9.52,23.75 9.14,24.13 9.14,25.78 9.42,26.05 ATSAMD21E.26
A3  (via drill 0.39)
  Top 0.254: DOTSTAR-A3.6 2.67,26.62 2.67,27.35 3.15,27.83 4.61,27.83 6.65,29.88 9.27,29.88 v10.16,30.77
  Bottom 0.254: v10.16,30.77 10.25,30.77 10.7,30.32 ATSAMD21E.1
ADDR  (via drill 0.39)
  Top 0.178: U1.18 21.08,16.76 20.64,16.32 | v20.07,14.86 20.17,14.86
  Top 0.203: 20.64,16.32 20.64,15.81 20.17,15.35 20.17,14.86 R5.3
  Bottom 0.203: SJ1.1 v20.07,14.86
CA1
  Top 0.178: 22.45,17.18 U1.21
  Top 0.203: 22.45,17.18 22.99,16.64 22.99,14.73 23.5,14.22 23.5,11.43 25.42,9.5 C1-2.C
  Top 0.254: C1-2.C C1-3.C C1-4.C C1-5.C C1-6.C C1-7.C | C1-7.C C1-8.C 26.54,24.77 26.54,22.22 C1-7.C
CA2  (via drill 0.39)
  Top 0.178: U1.22 23.17,17.98 23.24,17.91 23.24,17.02
  Top 0.203: 23.24,17.02 23.5,16.76 23.5,14.86 24,14.35 24,12.32 v24.26,12.06
  Top 0.254: C2-8.C C2-7.C C2-6.C C2-5.C C2-4.C C2-3.C C2-2.C 30.14,10.54 30.56,10.54 C3-2.A v29.85,11.3 | C4-2.A v32.38,11.3 | C5-2.A v34.92,11.3 | C6-2.A v37.46,11.3 | C7-2.A v40,11.3 | C8-2.A v42.54,11.3
  Bottom 0.203: 25.78,11.05 25.02,11.05 24.26,11.81 v24.26,12.06
  Bottom 0.254: v42.54,11.3 v40,11.3 v37.46,11.3 v34.92,11.3 v32.38,11.3 v29.85,11.3 29.59,11.05 25.78,11.05
CA3  (via drill 0.39)
  Top 0.178: U1.23 23.66,18.38 23.75,18.29
  Top 0.203: 23.75,18.29 23.75,17.14 24,16.89 24,14.99 24.51,14.48 24.51,12.95 25.27,12.19 v25.27,11.81
  Top 0.254: C3-2.C C3-3.C 32.68,13.08 33.1,13.08 C4-3.A v32.38,13.84 C3-4.C C3-5.C C3-6.C C3-7.C C3-8.C | v42.54,13.84 C8-3.A | C7-3.A v40,13.84 | C6-3.A v37.46,13.84 | C5-3.A v34.92,13.84 | C2-2.A 28.05,11.58 v27.81,11.81 | C1-2.A 25.51,11.58 v25.27,11.81
  Bottom 0.254: v25.27,11.81 v27.81,11.81 28.32,12.32 30.61,12.32 32.13,13.84 v32.38,13.84 v34.92,13.84 v37.46,13.84 v40,13.84 v42.54,13.84
CA4  (via drill 0.39)
  Top 0.178: U1.24 24.02,18.78 24.26,18.54 24.26,17.27
  Top 0.203: 24.26,17.27 24.51,17.02 24.51,15.11 v25.27,14.35
  Top 0.254: C4-2.C C4-3.C C4-4.C C4-5.C | C4-5.C C4-6.C C4-7.C C4-8.C | v42.54,16.38 C8-4.A | C7-4.A v40,16.38 | C6-4.A v37.46,16.38 | C5-4.A v34.92,16.38 C4-5.C | v27.3,13.84 C2-3.A | C3-3.A v29.85,13.84 | C1-3.A 25.51,14.12 v25.27,14.35
  Bottom 0.254: v42.54,16.38 v40,16.38 v37.46,16.38 v34.92,16.38 34.42,16.38 33.15,15.11 31.12,15.11 v29.85,13.84 v27.3,13.84 25.78,13.84 v25.27,14.35
CA5  (via drill 0.39)
  Top 0.178: U1.25 24.38,19.18 24.64,18.92 24.64,17.65 v25.4,16.89
  Top 0.254: C5-8.C C5-7.C C5-6.C | C5-6.C C5-5.C C5-4.C C5-3.C C5-2.C | C4-4.A v32.38,16.38 | v29.85,16.38 C3-4.A | C2-4.A v27.3,16.38 | v42.54,18.92 C8-5.A | C7-5.A v40,18.92 | C6-5.A v37.46,18.92 C5-6.C | C1-4.A 25.4,15.75 v25.4,16.89
  Bottom 0.254: v42.54,18.92 v40,18.92 v37.46,18.92 36.96,18.92 35.69,17.65 33.65,17.65 v32.38,16.38 v29.85,16.38 v27.3,16.38 25.91,16.38 v25.4,16.89
CA6  (via drill 0.39)
  Top 0.178: U1.26 25.13,19.58
  Top 0.254: C6-8.C C6-7.C | C6-2.C C6-3.C C6-4.C C6-5.C C6-6.C C6-7.C | C5-5.A v34.92,18.92 | v32.38,18.92 C4-5.A | C3-5.A v29.85,18.92 | C2-5.A v27.3,18.92 | C7-6.A v40,21.46 C6-7.C | v42.54,21.46 C8-6.A | C1-5.A 25.51,19.2 v25.27,19.43 25.13,19.58
  Bottom 0.254: v42.54,21.46 v40,21.46 38.99,21.46 37.46,19.94 35.94,19.94 v34.92,18.92 v32.38,18.92 v29.85,18.92 v27.3,18.92 25.78,18.92 v25.27,19.43
CA7  (via drill 0.39)
  Top 0.178: U1.27 24.76,19.98 C1-6.A
  Top 0.254: C7-2.C C7-3.C C7-4.C C7-5.C C7-6.C C7-7.C 41.8,23.26 v42.04,23.5 | v27.3,21.46 C2-6.A | C3-6.A v29.85,21.46 | C4-6.A v32.38,21.46 | C5-6.A v34.92,21.46 | C6-6.A v37.46,21.46 | C7-8.C 41.8,23.73 v42.04,23.5 | C8-7.A 42.27,23.26 v42.04,23.5 | C1-6.A 25.51,21.74 v25.27,21.97
  Bottom 0.254: v42.04,23.5 40.77,23.5 39.75,22.48 38.48,22.48 v37.46,21.46 v34.92,21.46 v32.38,21.46 v29.85,21.46 v27.3,21.46 25.78,21.46 v25.27,21.97
CA8  (via drill 0.39)
  Top 0.178: 24.38,21.34 23.43,20.38 U1.28
  Top 0.203: 25.3,23.26 C1-7.A
  Top 0.254: C8-2.C C8-3.C C8-4.C C8-5.C C8-6.C C8-7.C C8-8.C 44.34,23.73 v44.58,23.5 | C7-7.A v40,24 | v37.46,24 C6-7.A | C5-7.A v34.92,24 | C4-7.A v32.38,24 | C3-7.A v29.85,24 | C2-7.A v27.3,24 | 25.3,23.26 24.38,22.35 24.38,21.34 | C1-7.A 25.51,24.28 v25.34,24.45
  Bottom 0.254: v44.58,23.5 44.58,23.62 43.81,24.38 40.39,24.38 v40,24 v37.46,24 v34.92,24 v32.38,24 v29.85,24 v27.3,24 25.78,24 v25.34,24.45
CA9
  Top 0.178: 23.46,21.18 U1.1
  Top 0.203: 23.46,21.18 23.88,21.59 23.88,22.73 24.51,23.37 24.51,24.77
  Top 0.254: C8-8.A C7-8.A C6-8.A C5-8.A C4-8.A C3-8.A C2-8.A C1-8.A 25.51,25.76 24.51,24.77
CB1  (via drill 0.39)
  Top 0.178: U1.7 19.88,22.03 v19.24,22.67
  Top 0.254: 62.15,24.77 C2-9.A v62.86,24 | v60.32,24 C3-9.A | C4-9.A v57.78,24 | C5-9.A v55.24,24 | C6-9.A v52.7,24 | C7-9.A v50.16,24 | C8-9.A v47.62,24
  Bottom 0.203: 48.01,24 45.85,26.16 32,26.16 31.62,26.54 24.38,26.54 20.45,22.61 19.3,22.61 v19.24,22.67
  Bottom 0.254: v62.86,24 v60.32,24 v57.78,24 v55.24,24 v52.7,24 v50.16,24 48.01,24 v47.62,24
CB2  (via drill 0.39)
  Top 0.178: U1.8 19.08,21.68 18.29,22.48 v18.16,22.48
  Top 0.254: C2-15.C C2-14.C C2-13.C C2-12.C C2-11.C 61.06,22.22 | C2-9.C C2-10.C 61.06,22.22 | 61.06,22.22 59.61,22.22 C3-10.A v60.32,21.46 | v47.62,21.46 C8-10.A | C7-10.A v50.16,21.46 | C6-10.A v52.7,21.46 | C5-10.A v55.24,21.46 | C4-10.A v57.78,21.46
  Bottom 0.178: 20.57,21.97 18.8,21.97 18.29,22.48 v18.16,22.48
  Bottom 0.203: 48.13,21.46 48.13,22.22 46.61,23.75 46.61,24.77 45.72,25.65 31.75,25.65 31.37,26.04 24.64,26.04 20.57,21.97
  Bottom 0.254: v47.62,21.46 48.13,21.46 v50.16,21.46 v52.7,21.46 v55.24,21.46 v57.78,21.46 v60.32,21.46
CB3  (via drill 0.39)
  Top 0.178: U1.9 18.7,19.98 18.48,20.19 18.48,21.27 v18.29,21.46
  Top 0.254: C3-15.C C3-14.C C3-13.C C3-12.C 58.52,19.43 | 58.52,19.43 C3-11.C C3-10.C C3-9.C | 58.52,19.43 57.28,19.43 C4-11.A v57.78,18.92 | v47.62,18.92 C8-11.A | C7-11.A v50.16,18.92 | C6-11.A v52.7,18.92 | C5-11.A v55.24,18.92 | C2-10.A v62.86,21.46
  Bottom 0.203: 47.75,18.92 47.75,20.19 46.74,21.21 46.74,22.99 46.1,23.62 46.1,24.64 45.59,25.15 31.5,25.15 31.12,25.53 24.77,25.53 20.7,21.46 v18.29,21.46
  Bottom 0.254: v47.62,18.92 47.75,18.92 v50.16,18.92 v52.7,18.92 v55.24,18.92 v57.78,18.92 59.05,20.19 60.58,20.19 61.85,21.46 v62.86,21.46
CB4  (via drill 0.39)
  Top 0.178: U1.10 18.52,19.58 17.78,20.32 v17.78,20.57
  Top 0.254: 55.98,16.49 C4-12.C C4-11.C C4-10.C C4-9.C | 55.98,16.49 C4-13.C C4-14.C C4-15.C | v62.86,18.92 C2-11.A | C3-11.A v60.32,18.92 | v47.62,16.38 C8-12.A | C7-12.A v50.16,16.38 | C6-12.A v52.7,16.38 | 55.98,16.49 55.88,16.38 v55.24,16.38 | C5-12.A v55.24,16.38 | v55.24,16.38
  Bottom 0.203: 48.01,16.38 47.24,17.14 34.16,17.14 32.64,15.62 25.15,15.62 | 24.38,15.88 24.38,19.56 23.37,20.57 v17.78,20.57
  Bottom 0.254: v62.86,18.92 v60.32,18.92 59.82,18.92 58.8,17.91 56.77,17.91 v55.24,16.38 v52.7,16.38 v50.16,16.38 48.01,16.38 v47.62,16.38 | 24.38,15.88 24.64,15.62 25.15,15.62
CB5  (via drill 0.39)
  Top 0.178: 19.18,19.18 U1.11 17.91,19.18 v17.78,19.3
  Top 0.254: C4-12.A v57.78,16.38 | C2-12.A v62.86,16.38 | C3-12.A v60.32,16.38 | C5-15.C C5-14.C 53.45,14.58 | 53.45,14.58 C5-13.C C5-12.C C5-11.C C5-10.C C5-9.C | v52.7,13.84 53.45,14.58 | C7-13.A v50.16,13.84 | C8-13.A v47.62,13.84 | C6-13.A v52.7,13.84 | v52.7,13.84
  Bottom 0.203: 31.88,14.6 30.35,13.08 25.27,13.08 23.88,14.48 23.88,19.37 23.18,20.07 18.54,20.07 v17.78,19.3
  Bottom 0.254: v62.86,16.38 v60.32,16.38 v57.78,16.38 56.77,15.37 54.23,15.37 v52.7,13.84 v50.16,13.84 v47.62,13.84 46.86,14.6 31.88,14.6
CB6  (via drill 0.39)
  Top 0.178: U1.12 18.33,18.78 v17.78,18.22 17.84,18.22
  Top 0.254: v62.86,13.84 C2-13.A | C3-13.A v60.32,13.84 | C4-13.A v57.78,13.84 | C6-9.C C6-10.C C6-11.C C6-12.C C6-13.C C6-14.C 50.9,11.3 | 50.9,11.3 C6-15.C | C7-14.A v50.16,11.3 50.9,11.3 | C5-13.A v55.24,13.84 | C8-14.A 47.5,11.43 v47.75,11.43
  Bottom 0.203: v17.78,18.22 19.18,19.62 22.99,19.62 23.37,19.24 23.37,11.94 24.77,10.54 42.93,10.54 44.96,12.57 51.18,12.57 51.43,12.32
  Bottom 0.254: v62.86,13.84 v60.32,13.84 v57.78,13.84 v55.24,13.84 54.23,13.84 52.7,12.32 51.43,12.32 51.18,12.32 v50.16,11.3 50.04,11.43 v47.75,11.43
CB7  (via drill 0.39)
  Top 0.178: U1.13 18.7,18.38 18.48,18.16 18.48,17.21 v18.67,17.02
  Top 0.203: C7-15.C 47.95,10.56 C8-15.A 47.12,9.73
  Top 0.254: C4-14.A v57.78,11.3 | C2-14.A v62.86,11.3 | C3-14.A v60.32,11.3 | C7-9.C C7-10.C C7-11.C C7-12.C C7-13.C C7-14.C 48.36,12.02 48.64,11.75 48.64,10.84 C7-15.C 47.09,10.56 v46.99,10.67 | C6-14.A v52.7,11.3 | v55.24,11.3 C5-14.A
  Bottom 0.203: v18.67,17.02 19.18,17.53 22.61,17.53 22.86,17.27 22.86,11.81 24.64,10.03 43.05,10.03 43.94,10.92 | 47.24,10.54 50.93,10.54 51.69,11.3
  Bottom 0.254: v62.86,11.3 v60.32,11.3 v57.78,11.3 v55.24,11.3 v52.7,11.3 51.69,11.3 | 43.94,10.92 46.86,10.92 46.99,10.79 v46.99,10.67 47.12,10.54 47.24,10.54
CB8  (via drill 0.39)
  Top 0.178: U1.14 19.43,17.63 19.43,16.64 v19.81,16.26
  Top 0.203: C8-15.C 45.72,10.46
  Top 0.254: C8-9.C C8-10.C C8-11.C C8-12.C C8-13.C C8-14.C C8-15.C 45.59,10.33 v45.59,9.4 | C7-15.A 50.44,9.5 v50.67,9.27 | C6-15.A 53.11,9.5 v53.34,9.27 | C5-15.A 55.65,9.5 v55.88,9.27 | C4-15.A 58.19,9.5 v58.42,9.27 | C3-15.A 60.73,9.5 v60.96,9.27 61.89,9.27 C2-15.A
  Bottom 0.203: v45.59,9.4 45.47,9.52 | 45.47,9.52 24.51,9.52 22.35,11.68 22.35,16.19 22.16,16.38 19.94,16.38 v19.81,16.26 | 45.47,9.52 49.15,9.52 49.4,9.27 v50.67,9.27
  Bottom 0.254: v60.96,9.27 v58.42,9.27 v55.88,9.27 v53.34,9.27 v50.67,9.27
D+
  Bottom 0.254: USB-CONNECTOR.D+ 7.49,18.41 7.87,18.8 7.87,20.57 8.46,21.16 9.57,21.16 9.96,21.55 9.96,22.63 10.7,23.37 ATSAMD21E.24
D-  (via drill 0.39)
  Top 0.254: v10.79,22.38 9.9,22.38 7.8,20.29 v7.8,17.69
  Bottom 0.254: ATSAMD21E.23 11.2,22.79 v10.79,22.38 | v7.8,17.69 4.96,17.69 USB-CONNECTOR.D-
GND  (via drill 0.39)
  Top 0.178: U1.5 20.68,19.58
  Top 0.203: 20.68,19.58 U1.THERMAL
  Top 0.305: C5.2 21.02,24.9 21.33,25.21 21.33,25.45 C4.2
  Bottom 0.178: ATSAMD21E.10 14.97,28.57 15.62,28.57 15.69,28.65 15.69,28.79 15.87,28.97 15.87,29.08
  other vias: 18.29,15.05 17.27,7.37 21.08,18.8 22.73,31.81 14.99,20.32 80.58,29.15 12.45,27.3 9.14,20.19 11.3,13.72 6.1,21.21 4.45,13.59 8.89,26.8 10.79,8.25 12.83,11.68
  pour Top: 0,35.05 0,0 87.76,0 87.76,35.05
  pour Bottom: -0.13,34.93 -0.13,0 87.76,0 87.76,34.93
N$1  (via drill 0.39)
  Top 0.254: STATUS.A v5.21,24.89
  Bottom 0.254: v5.21,24.89 5.21,25.78 5.46,26.04 R1.1
N$2  (via drill 0.39)
  Top 0.254: v8.25,23.75 8.87,23.75 9.35,24.22 11.83,24.22 14.18,26.57 16.26,26.57 v17.02,27.34
  Bottom 0.254: R1.2 8.09,26.04 8.25,25.87 v8.25,23.75 | ATSAMD21E.13 16.77,27.05 17.02,27.3 v17.02,27.34
N$3
  Bottom 0.254: U4.8 12.96,6.36 12.57,5.97 12.06,5.97 11.62,5.52 R8.1
N$6
  Bottom 0.254: R4.1 2.58,10.69 PWR.A
N$8  (via drill 0.39)
  Top 0.254: v11.44,31.11 11.27,30.94 11.27,30.59 10.02,29.34 6.81,29.34 4.83,27.36 3.93,27.36 3.43,26.86 DOTSTAR-A3.5
  Bottom 0.254: v11.44,31.11 11.2,30.86 ATSAMD21E.2
PA11_FLASHCS
  Bottom 0.178: U3.1 19.56,29.21 19.69,29.08 19.69,28.7 19.18,28.19 18.67,28.19 18.54,28.07 18.54,27.34 R2.1
  Bottom 0.203: U3.1 18.15,28.32 17.89,28.07 17.89,26.98
  Bottom 0.254: 17.89,26.98 17.47,26.55 ATSAMD21E.14
PA16D_FLASHMOSI  (via drill 0.39)
  Top 0.254: v19.94,32.77 19.94,31.75 19.21,31.02 19.21,26.29 15.78,22.86 v15.4,22.86
  Bottom 0.254: U3.5 23.11,33.02 22.86,32.77 v19.94,32.77 | v15.4,22.86 15.4,22.95 14.2,24.16 ATSAMD21E.17
PA17D_FLASHSCK  (via drill 0.39)
  Top 0.254: v14.09,23.23 14.72,23.23 15.1,23.61 15.79,23.61 18.67,26.49 18.67,31.98 17.78,32.87 v16.26,32.87
  Bottom 0.254: U3.6 26.05,31.75 26.34,32.04 26.34,33.33 25.51,34.16 17.42,34.16 16.26,33 v16.26,32.87 | v14.09,23.23 13.71,23.61 13.71,24.79 ATSAMD21E.18
PA19D_FLASHMISO  (via drill 0.39)
  Top 0.254: v19.94,30.48 19.94,26.29 15.75,22.1 13.59,22.1 12.95,22.73 v12.95,22.99
  Bottom 0.254: U3.2 v19.94,30.48 | v12.95,22.99 12.95,23.37 12.7,23.62 12.7,24.04 ATSAMD21E.20
R_EXT
  Top 0.178: U1.6 20.28,22.63
  Top 0.254: 20.28,22.63 20.28,22.71 19.5,23.5 17.91,23.5 17.34,22.92 17.34,21.21 17.02,20.89 17.02,17.59 19.27,15.33 R5.4
SCL  (via drill 0.39, 0.4)
  Top 0.178: U1.20 21.88,15.69 | v22.61,8.76 v22.61,10.16
  Top 0.203: v22.61,10.16 22.61,10.79 22.99,11.18 22.99,14.1 22.42,14.67 21.87,14.67 R5.1 | v16.77,28.34 16.11,28.34 15.62,28.83 15.62,29.97 16,30.35 16.89,30.35 18.13,29.11 18.13,26.67 17.14,25.69 14.66,25.69 12.25,23.28 12.25,22.7 13.28,21.67 14.91,21.67 16.09,20.49 v16.09,14.6
  Top 0.254: 21.88,15.69 21.87,15.68 R5.1
  Bottom 0.178: v22.61,8.76 SCL.TP
  Bottom 0.203: v16.09,14.6 16.13,14.56 16.13,11.6 17.7,10.03 17.78,10.03 22.48,10.03 v22.61,10.16
  Bottom 0.254: ATSAMD21E.12 15.98,27.55 v16.77,28.34 | U4.4 15.63,7.88 17.78,10.03
SDA  (via drill 0.39, 0.4)
  Top 0.178: U1.19 21.48,16.53 21.21,16.26 | 15.49,11.94 15.51,11.96 | 15.79,11.68 15.83,11.64
  Top 0.203: 21.21,16.26 21.21,15.6 20.97,15.37 R5.2 20.97,12.7 22.23,12.7 22.48,12.45 22.48,11.3 21.78,10.6 21.21,10.03 17.44,10.03 15.83,11.64 15.51,11.96 11.74,15.73 11.74,23.41 14.43,26.1 16.98,26.1 17.72,26.84 17.72,28.89 17.02,29.59 v16.38,29.59
  Top 0.254: 21.78,10.6 21.78,8.95 v21.59,8.76
  Bottom 0.178: v16.38,29.59 16.38,28.94 16.07,28.63 16.07,28.27 15.86,28.05 ATSAMD21E.11 | v21.59,8.76 21.59,7.87 20.96,7.24 SDA.TP
  Bottom 0.254: U4.6 13.96,6.61 14.48,6.1 18.8,6.1 SDA.TP
SDO
  Bottom 0.254: U4.7 13.46,4.89 R3.2
SWC  (via drill 0.39)
  Top 0.254: SWC.TP 6.29,33.85 v7.87,32.26
  Bottom 0.254: ATSAMD21E.31 9.9,28.6 8.98,28.6 8,29.58 8,32.13 v7.87,32.26
SWD  (via drill 0.39)
  Top 0.254: v9.27,32.26 9.27,32.51 SWD.TP
  Bottom 0.254: ATSAMD21E.32 9.17,29.05 8.76,29.46 8.76,30.73 9.27,31.24 v9.27,32.26
VBAT
  Bottom 0.305: 1.4,5.71 0.76,6.35 0.76,19.68 1.4,20.32 3.05,20.32 5.27,22.54 C7.1
  Bottom 0.406: 1.4,5.71 4.7,5.71 8.51,1.91 59.18,1.91 63.95,6.67 66.74,6.67 67.31,6.1 S1.2 | D3.A 7.19,22.21 C7.1
VBAT_CELL
  Bottom 0.61: BT1.1 76.2,6.6 75.56,7.24 70.48,7.24 69.85,6.6 69.85,4.57 S1.1
VBUS
  Bottom 0.305: D2.A F1.2
VBUSRAW
  Bottom 0.305: F1.1 7.62,13.59 7.62,16.76 7.37,17.02 4.98,17.02 USB-CONNECTOR.VBUS
VCC
  Top 0.203: U1.3 21.48,21.86 21.84,22.22 22.48,22.22 22.99,22.73 22.99,23.5
VDDCORE1
  Bottom 0.178: ATSAMD21E.29 C6.1
VOUT
  Bottom 0.305: U2.3 12,21.27 12.32,20.95 12.32,19.68 12,19.37 U2.1 11.05,19.34 C2.1 10.87,17.77 D2.C D3.C

### Text on the board
tPlace: 0x74 | TIMOTHY GARCIA 2018 | POWER SWITCH
bPlace: DESIGNED AND MADE BY TIMOTHY GARCIA / OPEN SOURCE HARDWARE & SOFTWARE / www.timothygarcia.ca | Close Jumper to switch Addr: 0x77
bNames: SPI FLASH | ATSAMD21E18 / CIRCUITPYTHON & ARDUINO IDE COMPATIBLE | JLCJLCJLCJLC | MCU | 2032 / 3.3V | CELL BATTERY | USB | r1-11.19.2018 | XYZ | RESET | Timothy Garcia / MDIA2069 | SET TO OFF BEFORE PROGRAMMING | ON-OFF